# Altium schematic sheet schema_mixer.SchDoc
size A4
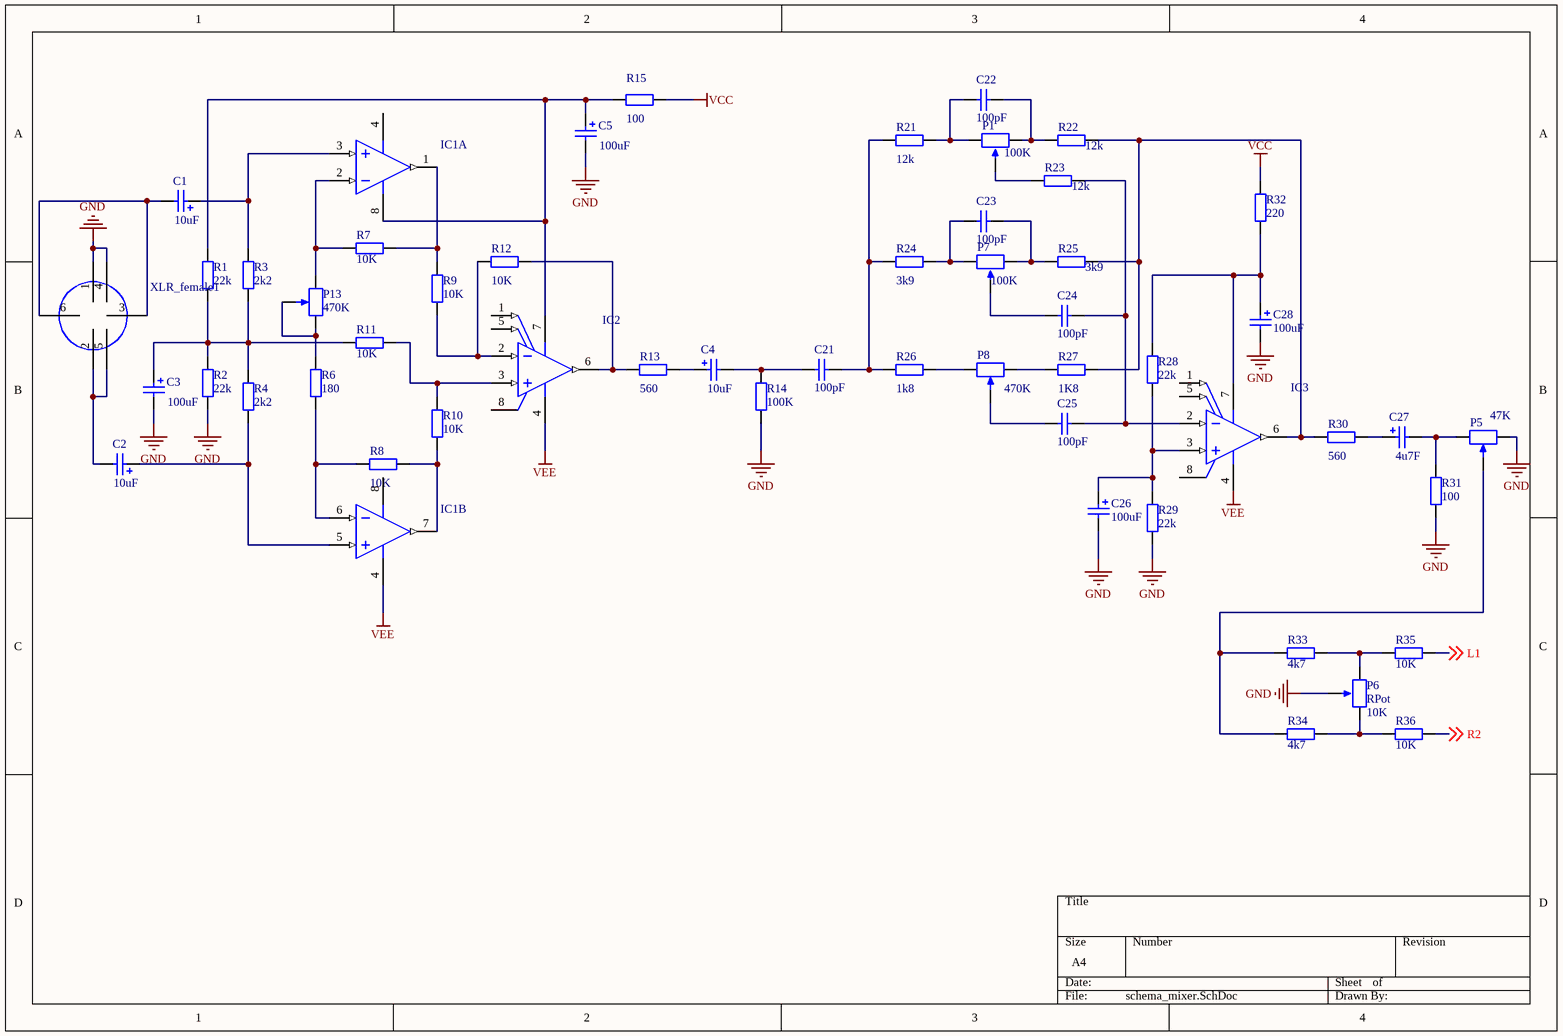
[diagram p0: schema_mixer.SchDoc]

## Parts
C1  value 10uF  [POLAR0.8]  (hidden comment: Cap Pol2)
C2  value 10uF  [POLAR0.8]  (hidden comment: Cap Pol2)
C3  value 100uF  [POLAR0.8]  (hidden comment: Cap Pol2)
C4  value 10uF  [POLAR0.8]  (hidden comment: Cap Pol2)
C5  value 100uF  [POLAR0.8]  (hidden comment: Cap Pol2)
C21  value 100pF  [RAD-0.3]  (hidden comment: Cap)
C22  value 100pF  [RAD-0.3]  (hidden comment: Cap)
C23  value 100pF  [RAD-0.3]  (hidden comment: Cap)
C24  value 100pF  [RAD-0.3]  (hidden comment: Cap)
C25  value 100pF  [RAD-0.3]  (hidden comment: Cap)
C26  value 100uF  [POLAR0.8]  (hidden comment: Cap Pol2)
C27  value 4u7F  [POLAR0.8]  (hidden comment: Cap Pol2)
C28  value 100uF  [POLAR0.8]  (hidden comment: Cap Pol2)
IC1  LM833DR2G  [OPAMP_LM833]  (value not drawn)  (parts A,B of 2)
IC2  TL061CD  [OPAMP_TL061]  (value not drawn)
IC3  TL061CD  [OPAMP_TL061]  (value not drawn)
P1  value 100K  [VR5]  (hidden comment: RPot)
P5  value 47K  [VR5]  (hidden comment: RPot)
P6  RPot  value 10K  [VR5]
P7  value 100K  [VR5]  (hidden comment: RPot)
P8  value 470K  [VR5]  (hidden comment: RPot)
P13  value 470K  [VR5]  (hidden comment: RPot)
R1  value 22k  [C1206]  (hidden comment: Res2)
R2  value 22k  [C1206]  (hidden comment: Res2)
R3  value 2k2  [C1206]  (hidden comment: Res2)
R4  value 2k2  [C1206]  (hidden comment: Res2)
R6  value 180  [C1206]  (hidden comment: Res2)
R7  value 10K  [C1206]  (hidden comment: Res2)
R8  value 10K  [C1206]  (hidden comment: Res2)
R9  value 10K  [C1206]  (hidden comment: Res2)
R10  value 10K  [C1206]  (hidden comment: Res2)
R11  value 10K  [C1206]  (hidden comment: Res2)
R12  value 10K  [C1206]  (hidden comment: Res2)
R13  value 560  [C1206]  (hidden comment: Res2)
R14  value 100K  [C1206]  (hidden comment: Res2)
R15  value 100  [C1206]  (hidden comment: Res2)
R21  value 12k  [C1206]  (hidden comment: Res2)
R22  value 12k  [C1206]  (hidden comment: Res2)
R23  value 12k  [C1206]  (hidden comment: Res2)
R24  value 3k9  [C1206]  (hidden comment: Res2)
R25  value 3k9  [C1206]  (hidden comment: Res2)
R26  value 1k8  [C1206]  (hidden comment: Res2)
R27  value 1K8  [C1206]  (hidden comment: Res2)
R28  value 22k  [C1206]  (hidden comment: Res2)
R29  value 22k  [C1206]  (hidden comment: Res2)
R30  value 560  [C1206]  (hidden comment: Res2)
R31  value 100  [C1206]  (hidden comment: Res2)
R32  value 220  [C1206]  (hidden comment: Res2)
R33  value 4k7  [C1206]  (hidden comment: Res2)
R34  value 4k7  [C1206]  (hidden comment: Res2)
R35  value 10K  [C1206]  (hidden comment: Res2)
R36  value 10K  [C1206]  (hidden comment: Res2)
XLR_female1  XLR_female  [XLR_Femail_Neutrik_NCJ6FA-V]  (value not drawn)

## Nets
GND: C3.2 C5.2 C26.2 C28.2 P5.2(BOT) P6.3(TAP) R2.1 R14.1 R29.1 R31.1 XLR_female1.1(GND) XLR_female1.4(Sleeve_/_GND)
VCC: R15.2 R32.2
VEE: IC1.4(VEE) IC2.4(VCC-) IC3.4(VCC-)
L1: R35.2 ; off-sheet L1
R2: R36.2 ; off-sheet R2
NetC1_1: C1.1 IC1.3(IN1+) R3.2
NetC1_2: C1.2 XLR_female1.3(negative) XLR_female1.6(Tip_/_pos)
NetC2_1: C2.1 IC1.5(IN2+) R4.1
NetC2_2: C2.2 XLR_female1.2(Pos) XLR_female1.5(Ring_/_neg)
NetC3_1: C3.1 R1.1 R2.2 R3.1 R4.2 R11.1
NetC4_1: C4.1 R13.2
NetC4_2: C4.2 C21.1 R14.2
NetC5_1: C5.1 IC1.8(VCC) IC2.7(VCC+) R1.2 R15.1
NetC21_2: C21.2 R21.1 R24.1 R26.1
NetC22_1: C22.1 P1.1(TOP) R21.2
NetC22_2: C22.2 P1.2(BOT) R22.1
NetC23_1: C23.1 P7.1(TOP) R24.2
NetC23_2: C23.2 P7.2(BOT) R25.1
NetC24_1: C24.1 P7.3(TAP)
NetC24_2: C24.2 C25.2 IC3.2(IN-) R23.2
NetC25_1: C25.1 P8.3(TAP)
NetC26_1: C26.1 IC3.3(IN+) R28.1 R29.2
NetC27_1: C27.1 R30.2
NetC27_2: C27.2 P5.1(TOP) R31.2
NetC28_1: C28.1 IC3.7(VCC+) R28.2 R32.1
NetIC1_1: IC1.1(OUT1) R7.2 R9.2
NetIC1_2: IC1.2(IN1-) P13.1(TOP) R7.1
NetIC1_6: IC1.6(IN2-) R6.1 R8.1
NetIC1_7: IC1.7(OUT2) R8.2 R10.1
NetIC2_2: IC2.2(IN-) R9.1 R12.1
NetIC2_3: IC2.3(IN+) R10.2 R11.2
NetIC2_6: IC2.6(OUT) R12.2 R13.1
NetIC3_6: IC3.6(OUT) R22.2 R25.2 R27.2 R30.1
NetP1_3: P1.3(TAP) R23.1
NetP5_3: P5.3(TAP) R33.1 R34.1
NetP6_1: P6.1(TOP) R33.2 R35.1
NetP6_2: P6.2(BOT) R34.2 R36.1
NetP8_1: P8.1(TOP) R26.2
NetP8_2: P8.2(BOT) R27.1
NetP13_2: P13.2(BOT) P13.3(TAP) R6.2

Not connected (* = marked no-connect by the designer): IC2 1(OFFSET_N1) 5(OFFSET_N2) 8(NC); IC3 1(OFFSET_N1) 5(OFFSET_N2) 8(NC)

## Library data of the parts
C1-C5 C26-C28 = Cap Pol2: Polarized Capacitor (Axial); Published: 8-Jun-2000; LatestRevisionDate: 17-Jul-2002; LatestRevisionNote: Re-released for DXP Platform.; PackageReference: POLAR0.8; Publisher: Altium Limited; PackageDescription: Polarized Capacitor; 2 Leads
C21-C25 = Cap: Capacitor; Published: 8-Jun-2000; LatestRevisionDate: 17-Jul-2002; LatestRevisionNote: Re-released for DXP Platform.; PackageReference: RAD-0.3; Publisher: Altium Limited; PackageDescription: Radial Cap, Thru-Hole; 2 Leads; 0.3 in Pin Spacing
IC1 = opamp_LM833: Low Noise, Audio Dual Operational Amplifier, -40 to 85 degC, 8-Pin SOIC, Pb-Free, Tape and Reel; Manufacturer: On Semiconductor; GBW Typ (MHz): 15; SR Typ (V/uS): 7; PackageReference: SOIC-8-751-07; ComponentLink3URL: http://www.onsemi.com/pub_link/Collateral/751-07.PDF; ComponentLink2URL: http://www.onsemi.cn/pub_link/Collateral/LM833-D.PDF; PackageVersion: Rev. AK, 02/2011; ComponentLink2Description: Datasheet; Mounting Technology: Surface Mount; Packing: Tape and Reel; PackageDescription: 8-Pin Small Outline Integrated Circuit, Body 4.9 x 3.9 mm, Pitch 1.27 mm; RoHS: TRUE; ComponentLink3Description: Package Specification; DatasheetVersion: Rev. 6; ComponentLink1URL: http://www.onsemi.com/; PartNumber: LM833DR2G; ComponentLink1Description: Manufacturer URL
IC2 = opamp_L061: Low-Power JFET-Input General-Purpose Operational Amplifier, 7 to 36 V, 0 to 70 degC, 8-pin SOIC (D8), Green (RoHS & no Sb/Br); Manufacturer: Texas Instruments; Sub Family: General Purpose Amplifier, High Supply Voltage Amplifier (>=30V), Low Power Amp (<=500uA); Iq per channel(Max)(mA): 0.25; CMRR(Min)(dB): 70; IIB(Max)(pA): 400; Slew Rate(Typ)(V/us): 3.5; Number of Channels: 1; Total Supply Voltage(Max)(+5V is 5, +/-5V is 10): 36; Vn at 1kHz(Typ)(nV/rtHz): 42; Vio (25C)(Max)(mV): 15; Rating: Military; Offset Drift(Typ)(uV/C): 10; Total Supply Voltage(Min)(+5V is 5, +/-5V is 10): 7; Eco-Plan: Green (RoHS & no Sb/Br); ComponentLink2Description: Datasheet; PackageReference: D0008A; ComponentLink3Description: Package Specification; ComponentLink2URL: http://www.ti.com/lit/ds/symlink/tl061.pdf; Mounting Technology: Surface Mount; ComponentLink1Description: Manufacturer URL; PackageDescription: 8-Pin Plastic Small Outline, Body 4.9 x 3.9 mm, Pitch 1.27 mm; DatasheetVersion: SLOS078J; PartNumber: TL061CD; Code_JEDEC: MS-012; GBW(Typ)(MHz): 1; ComponentLink3URL: http://www.ti.com/litv/pdf/msoi002j; ComponentLink1URL: http://www.ti.com/; PackageVersion: 4040047-3/M, 06/2011
IC3 = opamp_TL061: Low-Power JFET-Input General-Purpose Operational Amplifier, 7 to 36 V, 0 to 70 degC, 8-pin SOIC (D8), Green (RoHS & no Sb/Br); Manufacturer: Texas Instruments; Sub Family: General Purpose Amplifier, High Supply Voltage Amplifier (>=30V), Low Power Amp (<=500uA); Iq per channel(Max)(mA): 0.25; CMRR(Min)(dB): 70; IIB(Max)(pA): 400; Slew Rate(Typ)(V/us): 3.5; Number of Channels: 1; Total Supply Voltage(Max)(+5V is 5, +/-5V is 10): 36; Vn at 1kHz(Typ)(nV/rtHz): 42; Vio (25C)(Max)(mV): 15; Rating: Military; Offset Drift(Typ)(uV/C): 10; Total Supply Voltage(Min)(+5V is 5, +/-5V is 10): 7; Eco-Plan: Green (RoHS & no Sb/Br); ComponentLink2Description: Datasheet; PackageReference: D0008A; ComponentLink3Description: Package Specification; ComponentLink2URL: http://www.ti.com/lit/ds/symlink/tl061.pdf; Mounting Technology: Surface Mount; ComponentLink1Description: Manufacturer URL; PackageDescription: 8-Pin Plastic Small Outline, Body 4.9 x 3.9 mm, Pitch 1.27 mm; DatasheetVersion: SLOS078J; PartNumber: TL061CD; Code_JEDEC: MS-012; GBW(Typ)(MHz): 1; ComponentLink3URL: http://www.ti.com/litv/pdf/msoi002j; ComponentLink1URL: http://www.ti.com/; PackageVersion: 4040047-3/M, 06/2011
P1 P6 P7 = RPot: Potentiometer; Sim Note: Enter the Resistance value and the set point into parameter fields.; Set Position: 0.5; Published: 8-Jun-2000; LatestRevisionDate: 17-Jul-2002; LatestRevisionNote: Re-released for DXP Platform.; PackageReference: VR5; Publisher: Altium Limited; PackageDescription: Variable Resistor, Thru-Hole; 3 Leads
P5 P8 P13 = RPot_1: Potentiometer; Sim Note: Enter the Resistance value and the set point into parameter fields.; Set Position: 0.5; Published: 8-Jun-2000; LatestRevisionDate: 17-Jul-2002; LatestRevisionNote: Re-released for DXP Platform.; PackageReference: VR5; Publisher: Altium Limited; PackageDescription: Variable Resistor, Thru-Hole; 3 Leads
R1-R4 R6-R15 R21-R32 = Res2: Resistor; Published: 8-Jun-2000; LatestRevisionDate: 17-Jul-2002; LatestRevisionNote: Re-released for DXP Platform.; PackageReference: AXIAL-0.4; Publisher: Altium Limited; PackageDescription: Axial Device, Thru-Hole; 2 Leads; 0.4 in Pin Spacing
R33 R34 = Res2_13: Resistor; Published: 8-Jun-2000; LatestRevisionDate: 17-Jul-2002; LatestRevisionNote: Re-released for DXP Platform.; PackageReference: AXIAL-0.4; Publisher: Altium Limited; PackageDescription: Axial Device, Thru-Hole; 2 Leads; 0.4 in Pin Spacing
R35 R36 = Res2_3: Resistor; Published: 8-Jun-2000; LatestRevisionDate: 17-Jul-2002; LatestRevisionNote: Re-released for DXP Platform.; PackageReference: AXIAL-0.4; Publisher: Altium Limited; PackageDescription: Axial Device, Thru-Hole; 2 Leads; 0.4 in Pin Spacing